# EAGLE design untitled (EAGLE 9.6.2)
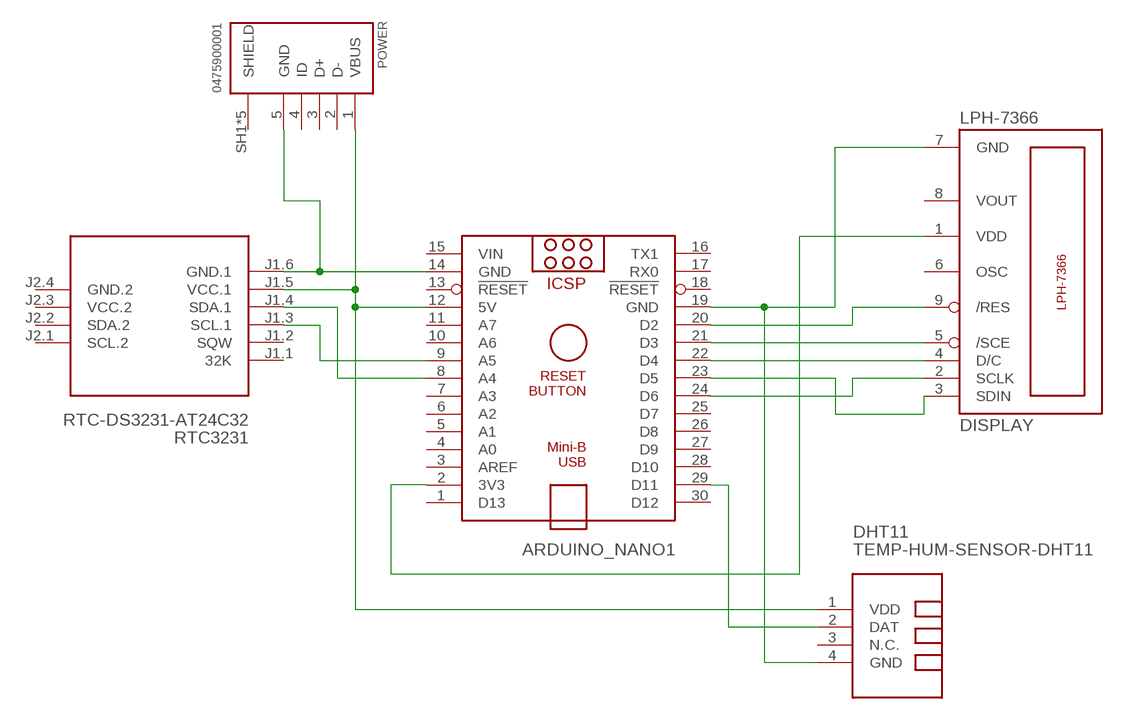
[diagram p0: schematic, sheet 1]

## Parts
ARDUINO_NANO1  ARDUINO_NANO  [ARDUINO_NANO]
DHT11  TEMP-HUM-SENSOR-DHT11  [TEMP-HUM-SENSOR-DHT11]
DISPLAY  LPH-7366  [LPH-7366]
POWER  0475900001  [0475900001]
RTC3231  RTC-DS3231-AT24C32  [RTC-DS3231-AT24C32]

## Nets
N$1: ARDUINO_NANO1.20(D2) DISPLAY.9(/RES)
N$2: ARDUINO_NANO1.21(D3) DISPLAY.5(/SCE)
N$3: ARDUINO_NANO1.22(D4) DISPLAY.4(D/C)
N$4: ARDUINO_NANO1.23(D5) DISPLAY.3(SDIN)
N$5: ARDUINO_NANO1.24(D6) DISPLAY.2(SCLK)
N$6: ARDUINO_NANO1.2(3V3) DISPLAY.1(VDD)
N$7: ARDUINO_NANO1.19(GND) DHT11.4(GND) DISPLAY.7(GND)
N$8: ARDUINO_NANO1.14(GND) POWER.5(GND) RTC3231.J1.6(GND.1)
N$9: ARDUINO_NANO1.12(5V) DHT11.1(VDD) POWER.1(VBUS) RTC3231.J1.5(VCC.1)
N$10: ARDUINO_NANO1.8(A4) RTC3231.J1.4(SDA.1)
N$11: ARDUINO_NANO1.9(A5) RTC3231.J1.3(SCL.1)
N$12: ARDUINO_NANO1.29(D11) DHT11.2(DAT)
Unconnected: ARDUINO_NANO1.1(D13) ARDUINO_NANO1.3(AREF) ARDUINO_NANO1.4(A0) ARDUINO_NANO1.5(A1) ARDUINO_NANO1.6(A2) ARDUINO_NANO1.7(A3) ARDUINO_NANO1.10(A6) ARDUINO_NANO1.11(A7) ARDUINO_NANO1.13(!RESET) ARDUINO_NANO1.16(TX1) ARDUINO_NANO1.17(RX0) ARDUINO_NANO1.18(!RESET) ARDUINO_NANO1.25(D7) ARDUINO_NANO1.26(D8) ARDUINO_NANO1.27(D9) ARDUINO_NANO1.28(D10) ARDUINO_NANO1.30(D12) DHT11.3(N.C.) DISPLAY.6(OSC) DISPLAY.8(VOUT) POWER.2(D-) POWER.3(D+) POWER.4(ID) RTC3231.J1.1(32K) RTC3231.J1.2(SQW) RTC3231.J2.1(SCL.2) RTC3231.J2.2(SDA.2)

## Power pins joined to a net without a drawn wire
GND.2: RTC3231.J2.4(GND.2)
SHIELD: POWER.SH1(SHIELD) POWER.SH2(SHIELD) POWER.SH3(SHIELD) POWER.SH4(SHIELD) POWER.SH5(SHIELD)
VCC.2: RTC3231.J2.3(VCC.2)
VIN: ARDUINO_NANO1.15(VIN)

## Library data of the parts
ARDUINO_NANO1 = ArduinoNanoV30:ARDUINO_NANO: Arduino Nano V3.0 Overview: The Arduino Nano is a small, complete, and breadboard-friendly board based on the ATmega328 (Arduino Nano 3.x) or ATmega168 (Arduino Nano 2.x). It has more or less the same functionality of the Arduino Duemilanove, but in a different package. It lacks only a DC power jack, and works with a Mini-B USB cable instead of a standard one. The Nano was designed and is being produced by Gravitech. Specifications: Microcontroller Atmel ATmega168 or ATmega328 Operating Voltage (logic level) 5 V Input Voltage (recommended) 7-12 V Input Voltage (limits) 6-20 V Digital I/O Pins 14 (of which 6 provide PWM output) Analog Input Pins 8 DC Current per I/O Pin 40 mA Flash Memory 16 KB (ATmega168) or 32 KB (ATmega328) of which 2 KB used by bootloader SRAM 1 KB (ATmega168) or 2 KB (ATmega328) EEPROM 512 bytes (ATmega168) or 1 KB (ATmega328) Clock Speed 16 MHz Dimensions 0.73" x 1.70" Length 45 mm Width 18 mm Weigth 5 g Power: The Arduino Nano can be powered via the Mini-B USB connection, 6-20V unregulated external power supply (pin 30), or 5V regulated external power supply (pin 27). The power source is automatically selected to the highest voltage source. Memory: The ATmega168 has 16 KB of flash memory for storing code (of which 2 KB is used for the bootloader); the ATmega328 has 32 KB, (also with 2 KB used for the bootloader). The ATmega168 has 1 KB of SRAM and 512 bytes of EEPROM (which can be read and written with the EEPROM library); the ATmega328 has 2 KB of SRAM and 1 KB of EEPROM. Input and Output: Each of the 14 digital pins on the Nano can be used as an input or output, using pinMode(), digitalWrite(), and digitalRead() functions. They operate at 5 volts. Each pin can provide or receive a maximum of 40 mA and has an internal pull-up resistor (disconnected by default) of 20-50 kOhms. In addition, some pins have specialized functions. Visit Arduino - ArduinoBoardNano <https://www.arduino.cc/en/Main/ArduinoBoardNano>
DHT11 = all_DIY:TEMP-HUM-SENSOR-DHT11: DHT11 - digital humidity & temperature sensor DHT11 datasheet available here: https://akizukidenshi.com/download/ds/aosong/DHT11.pdf Click here to find device on ebay.com <http://www.ebay.com/sch/dht11+digital+sensor>
DISPLAY = lph-7366:LPH-7366
POWER = USB connector:0475900001: CONN RCPT MICRO USB AB 5P SMD RA Manufacturer's datasheet <https://www.molex.com/pdm_docs/sd/475900001_sd.pdf>; CREATED_BY: PCBLayout.com; DIGIKEY_PARTNO: WM17144TR-ND; MANUFACTURER: Molex; MPN: 0475900001
RTC3231 = all_DIY:RTC-DS3231-AT24C32: RTC Module with Battery and EEPROM based on DS3231 and AT24C32 chips Tutorial can be found here: https://edwardmallon.wordpress.com/2014/05/21/using-a-cheap-3-ds3231-rtc-at24c32-eeprom-from-ebay/ Click here to find device on ebay.com <http://www.ebay.com/sch/DS3231+AT24C32+module>

## Board
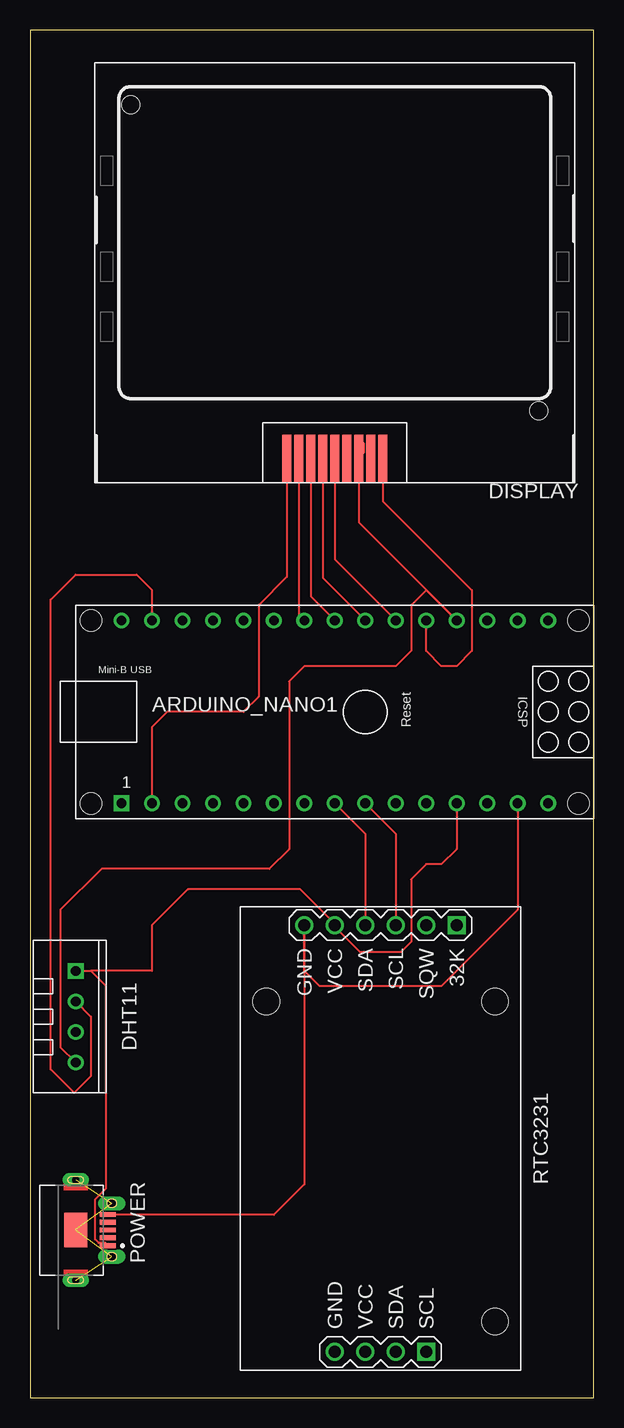
[diagram p1: board, top side]

Size 46.97 x 113.97 mm. Coordinates in mm from the lower left corner, seen from the top.
Outline: 0,0 46.97,0 46.97,113.97 0,113.97 0,0
Copper layers (1*16): Top 0.035mm / dielectric 1.5mm / Bottom 0.035mm
Design rules "default": minimum track width 6mil, minimum drill 0.35mm, track to track 6mil, track to pad 6mil, pad to pad 6mil, via to via 6mil, smd to smd 6mil, copper to edge 40mil, drill to drill 6mil, minimum pad ring 10mil, minimum via ring 8mil, stop-mask expansion 4mil, vias tented up to drill 0mil, thermal gap 10mil

### Footprints (pad centres in the part's own frame; a part is rotated, then mirrored left to right if it is on the bottom)
ARDUINO_NANO = drill 0.8 square: 1 -20.32,-7.62 | drill 0.8: 2 -17.78,-7.62; 3 -15.24,-7.62; 4 -12.7,-7.62; 5 -10.16,-7.62; 6 -7.62,-7.62; 7 -5.08,-7.62; 8 -2.54,-7.62; 9 0,-7.62; 10 2.54,-7.62; 11 5.08,-7.62; 12 7.62,-7.62; 13 10.16,-7.62; 14 12.7,-7.62; 15 15.24,-7.62; 16 15.24,7.62; 17 12.7,7.62; 18 10.16,7.62; 19 7.62,7.62; 20 5.08,7.62; 21 2.54,7.62; 22 0,7.62; 23 -2.54,7.62; 24 -5.08,7.62; 25 -7.62,7.62; 26 -10.16,7.62; 27 -12.7,7.62; 28 -15.24,7.62; 29 -17.78,7.62; 30 -20.32,7.62 | hole 1.778: -22.86,-7.62; -22.86,7.62; 17.78,7.62; 17.78,-7.62
TEMP-HUM-SENSOR-DHT11 = drill 0.8 square: 1 -3.81,0 | drill 0.8: 2 -1.27,0; 3 1.27,0; 4 3.81,0
LPH-7366 = smd 0.75 x 4: 1 4,17; 2 3,17; 3 2,17; 4 1,17; 5 0,17; 6 -1,17; 7 -2,17; 8 -3,17; 9 -4,17 | hole 1.5: -17,13; 17,-12.5
0475900001 = smd 0.4 x 1.35: 1 1.3,2.675; 2 0.65,2.675; 3 0,2.675; 4 -0.65,2.675; 5 -1.3,2.675 | drill 0.65 pad 0.85 long: SH1 -2.225,3; SH2 2.225,3 | drill 0.6 pad 0.8 long: SH3 -4.175,0; SH4 4.175,0 | smd 2.9 x 1.9: SH5 0,0
RTC-DS3231-AT24C32 = drill 1 square: J1.1 -17.78,6.35; J2.1 17.78,3.81 | drill 1: J1.2 -17.78,3.81; J1.3 -17.78,1.27; J1.4 -17.78,-1.27; J1.5 -17.78,-3.81; J1.6 -17.78,-6.35; J2.2 17.78,1.27; J2.3 17.78,-1.27; J2.4 17.78,-3.81 | hole 2.2: -11.43,-9.525; -11.43,9.525; 15.24,9.525

### Placement (x,y rotation side)
ARDUINO_NANO1  27.94,57.15 0 top
DHT11  3.81,31.75 270 top
DISPLAY  25.4,95.25 180 top
POWER  3.81,13.97 270 top
RTC3231  29.21,21.59 270 top

### Tracks (layer width: path | path; a pad name or v marks a point on that pad's centre or on a via)
N$1
  Top 0.152: DISPLAY.9 29.4,74.72 36.83,67.29 36.83,62.23 35.56,60.96 34.29,60.96 33.02,62.23 ARDUINO_NANO1.20
N$2
  Top 0.152: DISPLAY.5 25.4,69.85 ARDUINO_NANO1.21
N$3
  Top 0.152: DISPLAY.4 24.4,68.31 ARDUINO_NANO1.22
N$4
  Top 0.152: DISPLAY.3 23.4,66.77 ARDUINO_NANO1.23
N$5
  Top 0.152: DISPLAY.2 22.4,65.23 ARDUINO_NANO1.24
N$6
  Top 0.152: 10.16,55.9 10.16,55.88 | 10.16,55.88 ARDUINO_NANO1.2 | 10.16,55.88 11.43,57.15 17.78,57.15 19.05,58.42 19.05,66.04 21.4,68.39 DISPLAY.1
N$7
  Top 0.152: 27.8,78.74 27.8,79.55 27.54,79.81 27.53,79.81 27.53,78.28 DISPLAY.7 27.4,72.93 ARDUINO_NANO1.19 35.54,64.77 33.01,67.3 31.75,66.04 31.75,62.23 30.48,60.96 22.86,60.96 21.59,59.69 21.59,45.72 19.94,44.07 5.97,44.07 2.54,40.64 2.54,34.29 2.54,29.21 DHT11.4
N$8
  Top 0.152: ARDUINO_NANO1.14 40.64,40.64 34.29,34.29 24.13,34.29 22.86,35.56 RTC3231.J1.6 22.86,17.78 20.32,15.24 6.52,15.24 POWER.5
N$9
  Top 0.152: POWER.1 6.26,12.89 5.72,12.89 5.42,13.18 5.42,16.53 6.35,17.46 6.35,34.29 5.08,35.56 | DHT11.1 5.08,35.56 | ARDUINO_NANO1.12 35.56,45.72 34.29,44.45 33.02,44.45 31.75,43.18 31.75,37.98 30.89,37.12 27.53,37.12 25.4,39.25 RTC3231.J1.5 25.4,39.49 22.53,42.36 13.15,42.36 10.16,39.37 10.16,35.56 5.08,35.56
N$10
  Top 0.152: ARDUINO_NANO1.8 27.94,46.99 RTC3231.J1.4
N$11
  Top 0.152: ARDUINO_NANO1.9 30.48,46.99 RTC3231.J1.3
N$12
  Top 0.152: ARDUINO_NANO1.29 10.16,67.31 8.89,68.58 3.81,68.58 1.73,66.5 1.73,27.36 3.68,25.4 5.08,26.8 5.08,31.75 DHT11.2
SHIELD  (4 unrouted)
  Top 0.152: 3.81,14.02 POWER.SH5